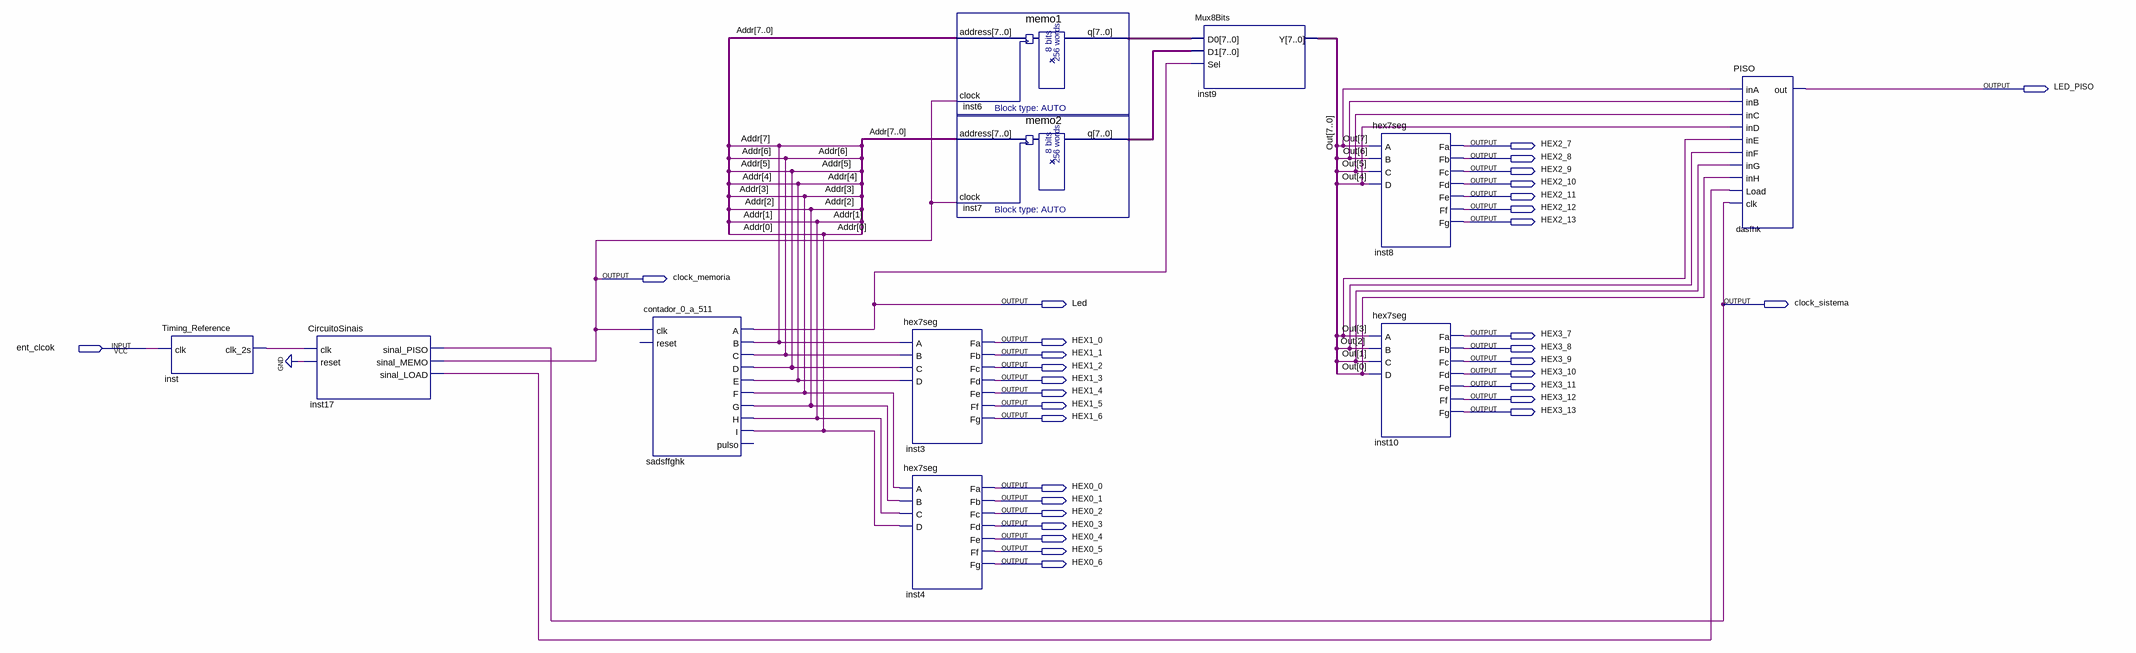
[diagram p0: schematic sheet]
// Quartus schematic LAB07.bdf as structural Verilog: 11 symbols, 33 pins
module LAB07 (
  input  ent_clcok,
  output LED_PISO,
  output HEX2_7,
  output HEX2_8,
  output HEX2_9,
  output HEX2_10,
  output HEX2_11,
  output HEX2_12,
  output HEX2_13,
  output clock_memoria,
  output Led,
  output clock_sistema,
  output HEX3_7,
  output HEX1_0,
  output HEX3_8,
  output HEX1_1,
  output HEX3_9,
  output HEX1_2,
  output HEX3_10,
  output HEX1_3,
  output HEX3_11,
  output HEX1_4,
  output HEX3_12,
  output HEX1_5,
  output HEX3_13,
  output HEX1_6,
  output HEX0_0,
  output HEX0_1,
  output HEX0_2,
  output HEX0_3,
  output HEX0_4,
  output HEX0_5,
  output HEX0_6
);

  wire inst17_sinal_load, inst_clk_2s;
  wire [7:0] Addr, inst6_q, inst7_q, Out;

  Timing_Reference inst (.clk(ent_clcok), .clk_2s(inst_clk_2s));
  CircuitoSinais inst17 (
    .clk(inst_clk_2s), .reset(1'b0), .sinal_PISO(clock_sistema), .sinal_MEMO(clock_memoria),
    .sinal_LOAD(inst17_sinal_load));
  contador_0_a_511 sadsffghk (
    .clk(clock_memoria), .A(Led), .B(Addr[7]), .C(Addr[6]), .D(Addr[5]), .E(Addr[4]), .F(Addr[3]),
    .G(Addr[2]), .H(Addr[1]), .I(Addr[0]));  // open: reset, pulso
  hex7seg inst3 (
    .A(Addr[7]), .B(Addr[6]), .C(Addr[5]), .D(Addr[4]), .Fa(HEX1_0), .Fb(HEX1_1), .Fc(HEX1_2), .Fd(HEX1_3),
    .Fe(HEX1_4), .Ff(HEX1_5), .Fg(HEX1_6));
  hex7seg inst4 (
    .A(Addr[3]), .B(Addr[2]), .C(Addr[1]), .D(Addr[0]), .Fa(HEX0_0), .Fb(HEX0_1), .Fc(HEX0_2), .Fd(HEX0_3),
    .Fe(HEX0_4), .Ff(HEX0_5), .Fg(HEX0_6));
  memo1 inst6 (.address(Addr), .clock(clock_memoria), .q(inst6_q));
  memo2 inst7 (.address(Addr), .clock(clock_memoria), .q(inst7_q));
  Mux8Bits inst9 (.D0(inst6_q), .D1(inst7_q), .Sel(Led), .Y(Out));
  hex7seg inst8 (
    .A(Out[7]), .B(Out[6]), .C(Out[5]), .D(Out[4]), .Fa(HEX2_7), .Fb(HEX2_8), .Fc(HEX2_9), .Fd(HEX2_10),
    .Fe(HEX2_11), .Ff(HEX2_12), .Fg(HEX2_13));
  hex7seg inst10 (
    .A(Out[3]), .B(Out[2]), .C(Out[1]), .D(Out[0]), .Fa(HEX3_7), .Fb(HEX3_8), .Fc(HEX3_9), .Fd(HEX3_10),
    .Fe(HEX3_11), .Ff(HEX3_12), .Fg(HEX3_13));
  PISO dasfhk (
    .inA(Out[7]), .inB(Out[6]), .inC(Out[5]), .inD(Out[4]), .inE(Out[3]), .inF(Out[2]), .inG(Out[1]),
    .inH(Out[0]), .Load(inst17_sinal_load), .clk(clock_sistema), .out(LED_PISO));
endmodule
